# EasyEDA Pro project 校赛123.eprj, board PCB9
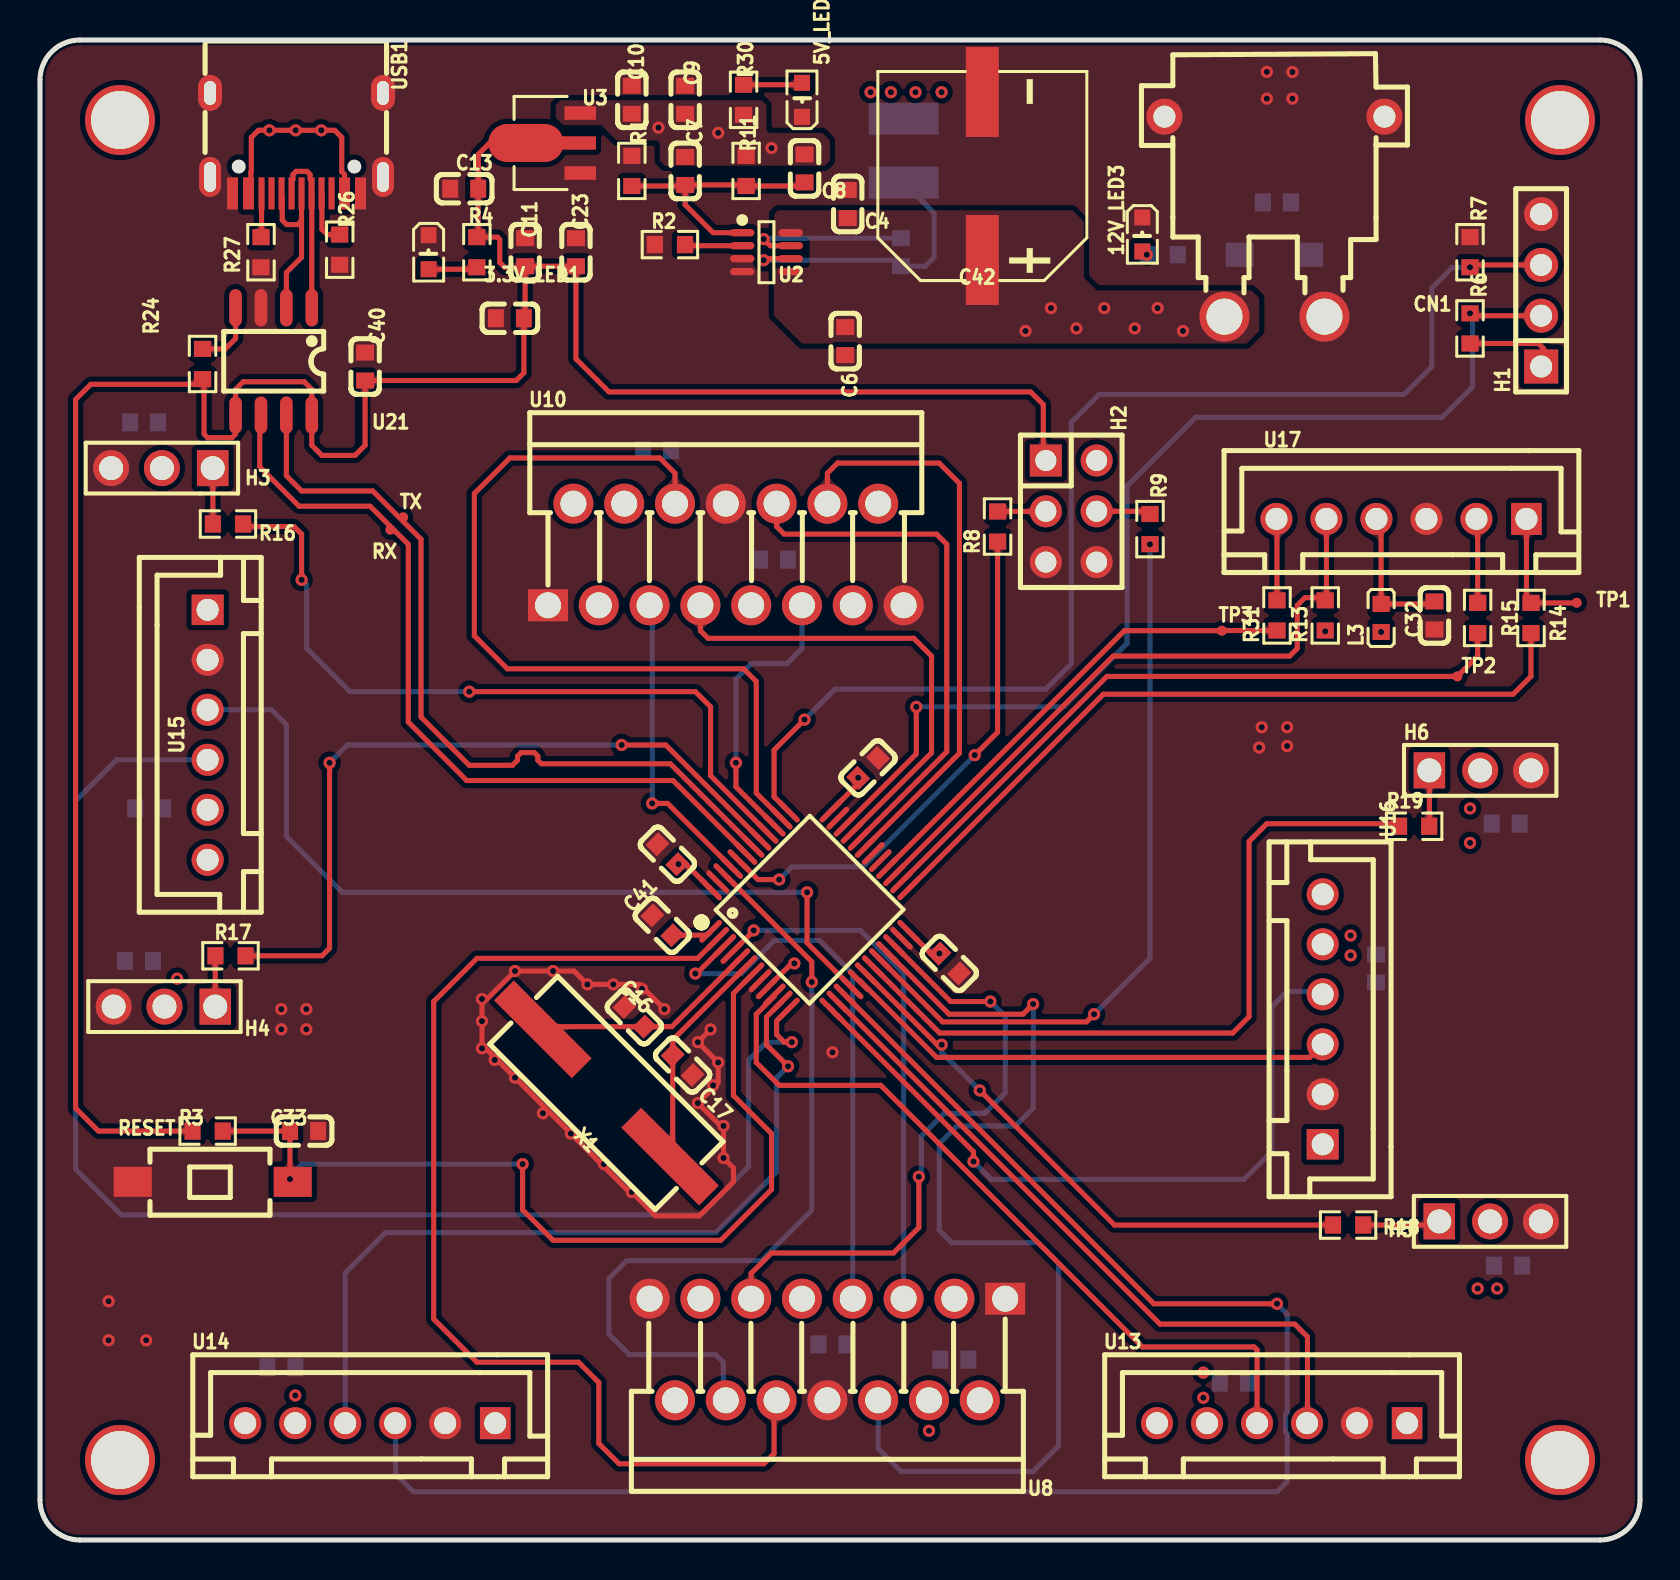
[diagram p4: board, top side]
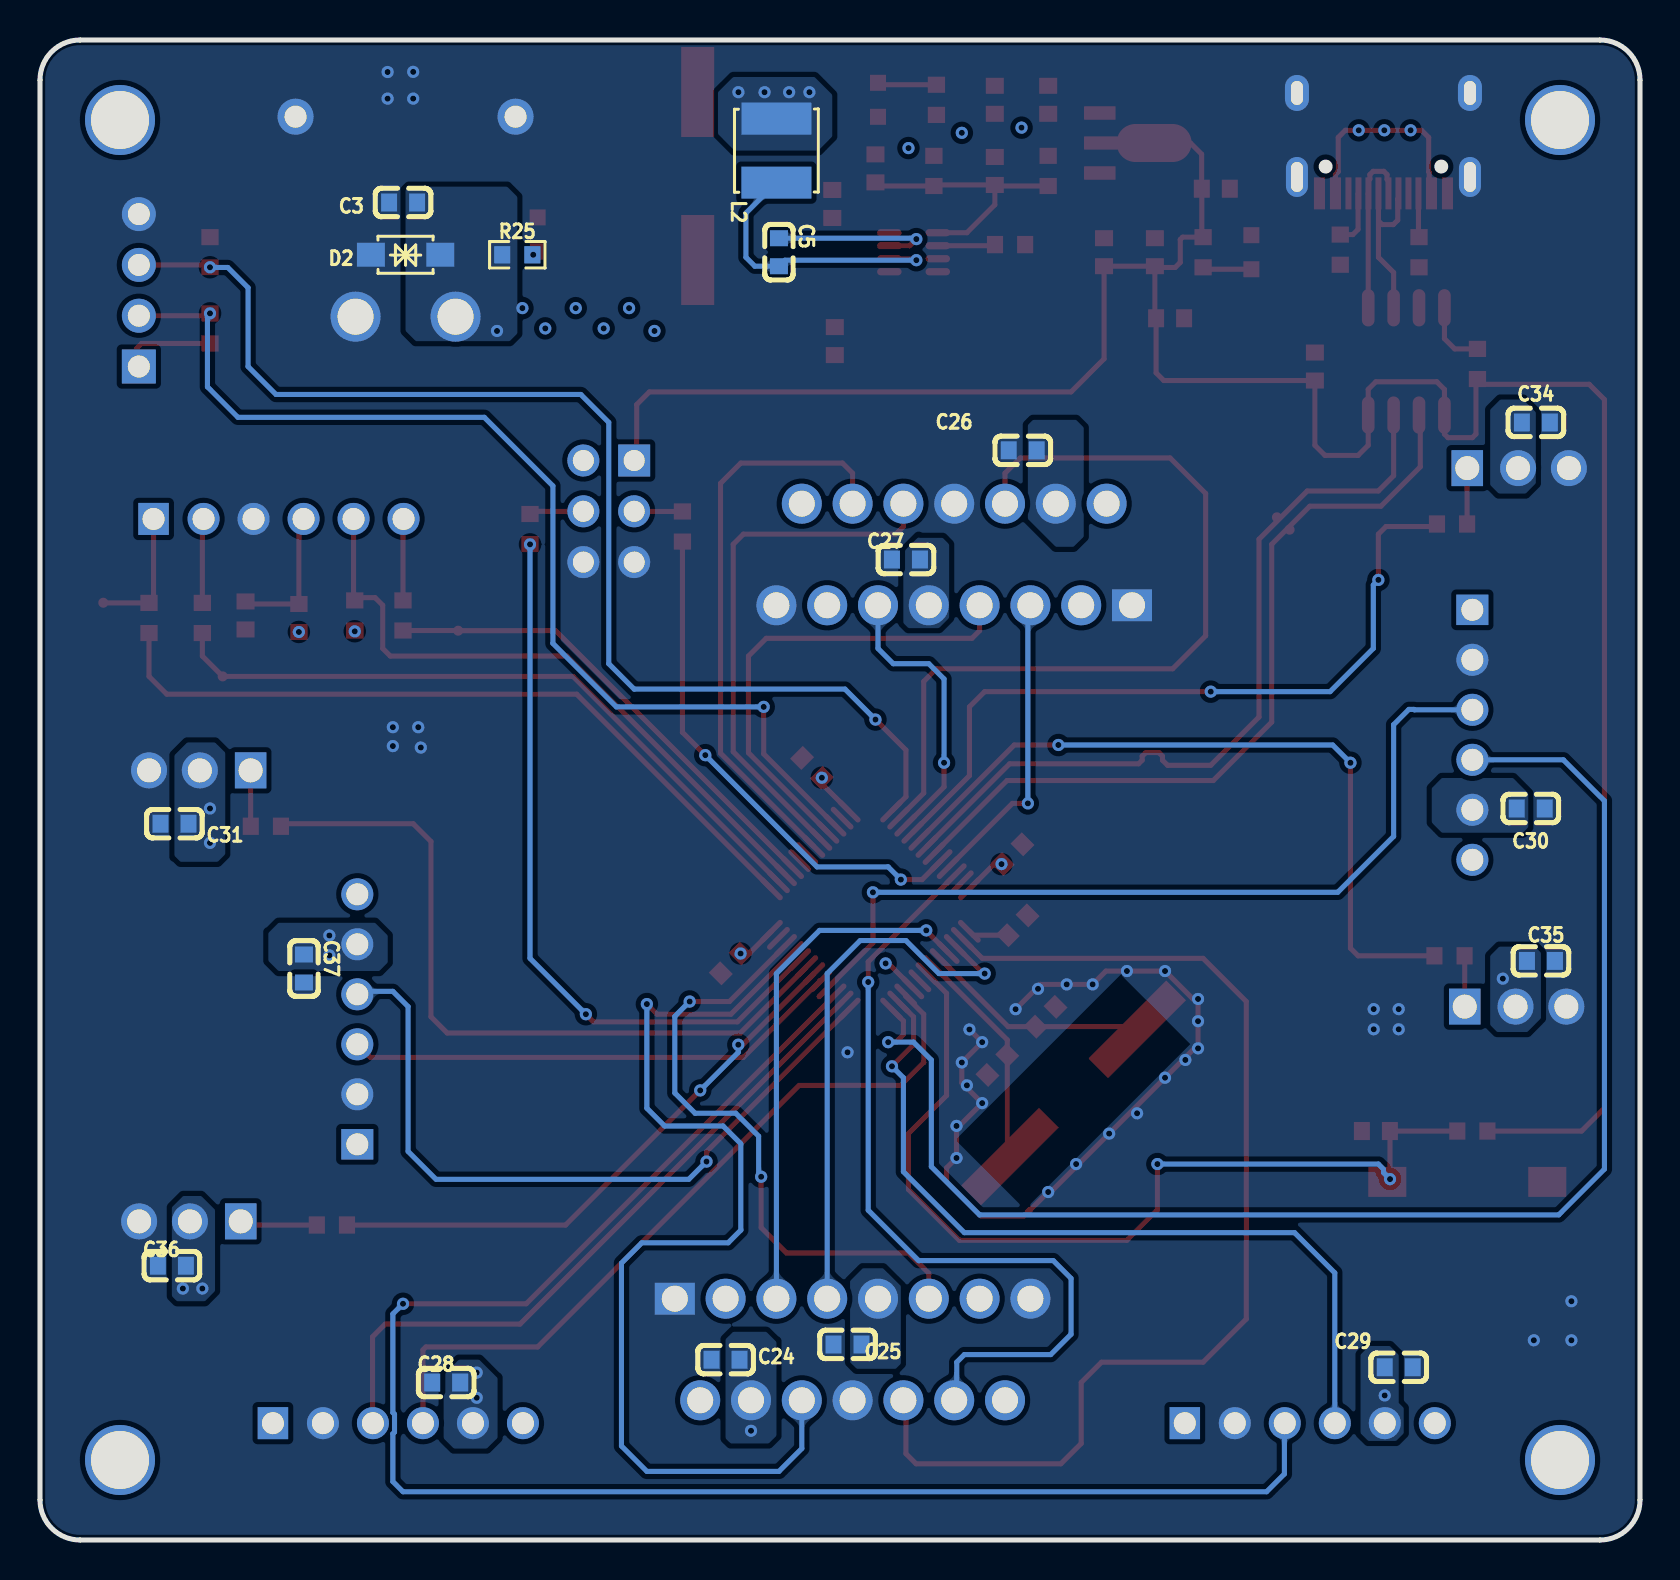
[diagram p5: board, bottom side, seen from below]

Outline 80 x 75 mm; copper layers: Top Layer, Inner1, Inner2, Bottom Layer. Coordinates in mm from the lower left corner of the outline.
Outline path: 0,73 0,2 arc(0.59,0.59) 2,0 78,0 arc(79.41,0.59) 80,2 80,73 arc(79.41,74.41) 78,75 2,75 arc(0.59,74.41) 0,73
Stack: Top Layer 0.035mm 外层铜厚1oz / Dielectric1 0.2104mm 7628 RC49% 8.6mil / Inner1 0.0152mm 内层铜厚 / Dielectric2 1.065mm 1.1mm H/HOZ Copper / Inner2 0.0152mm 内层铜厚 / Dielectric3 0.2104mm 7628 RC49% 8.6mil / Bottom Layer 0.035mm 外层铜厚1oz

## Design rules (mm)
net OSCIN: DP1
net OSCOUT: DP1
net TX: DP3
net RX: DP3
template: 自定义配置
spacing copperThickness1oz (default): track to track 0.102, other pairs 0.152 to 0.3
spacing copperThickness2oz: track to track 0.203, other pairs 0.152 to 0.3
track width copperThickness1oz (default): min 0.127, default 0.254, max 2.54
track width copperThickness2oz: min 0.203, default 0.254, max 2.54
differential pair differentialPair (default): width min 0.127, default 0.254, max 2.54; gap min 0.152, default 0.152
via viaSize (default): diameter min 0.5, default 0.61, max 10; hole min 0.3, default 0.305, max 6.3

## Placement (name value [footprint] x y rotation side)
3.3V_LED1  SZYY0603R  [LED0603-R-RD]  19.43 64.39 270 top
5V_LED2  SZYY0603R  [LED0603-R-RD]  38.1 72.01 90 top
12V_LED3  SZYY0603R  [LED0603-R-RD]  55.12 65.28 270 top
C3  100nF  [C0603]  61.85 66.88 180 bottom
C4  4.7uF  [C0603]  40.39 66.8 270 top
C5  10nF  [C0603]  43.05 64.39 270 bottom
C6  100nF  [C0603]  40.26 59.94 90 top
C7  22uF  [C0603]  32.26 68.45 270 top
C8  100nF  [C0603]  38.23 68.58 90 top
C9  22uF  [C0603]  32.26 72.01 270 top
C10  22uF  [C0603]  29.59 72.01 270 top
C11  100nF  [C0603]  24.26 64.39 270 top
C13  10uF  [C0603]  21.21 67.56 0 top
C16  18pF  [C0603]  29.72 26.16 315 top
C17  18pF  [C0603]  32.13 23.75 135 top
C19  100nF  [C0603]  23.5 61.09 0 top
C20  100nF  [C0603]  45.47 28.83 135 top
C21  100nF  [C0603]  31.37 34.29 315 top
C22  100nF  [C0603]  41.4 38.61 225 top
C23  47uF  [C0603]  26.8 64.39 270 top
C24  100nF  [C0603]  45.72 9.02 180 bottom
C25  100nF  [C0603]  39.62 9.78 0 bottom
C26  100nF  [C0603]  30.86 54.48 180 bottom
C27  100nF  [C0603]  36.7 49.02 0 bottom
C28  100nF  [C0603]  59.69 7.87 0 bottom
C29  100nF  [C0603]  12.06 8.64 180 bottom
C30  100nF  [C0603]  5.46 36.58 180 bottom
C31  100nF  [C0603]  73.28 35.81 0 bottom
C32  100nF  [C0603]  69.72 46.23 270 top
C33  10uF  [C0603]  13.2 20.45 180 top
C34  10pF  [C0603]  5.21 55.88 180 bottom
C35  10pF  [C0603]  4.95 28.96 180 bottom
C36  10pF  [C0603]  73.41 13.72 0 bottom
C37  10pF  [C0603]  66.8 28.58 270 bottom
C40  100nF  [C0603]  16.26 58.67 90 top
C41  100nF  [C0603]  31.12 30.73 315 top
C42  470uF  [CAP-SMD_BD10.0-L10.3-W10.3-LS11.0]  47.12 68.2 90 top
CN1  XT30PW-M30.G.Y  [CONN-TH_XT30PW-M]  61.72 66.17 180 top
D2  SMF24CA  [SOD-123FL_L2.7-W1.8-LS3.8-BI]  61.72 64.26 180 bottom
H1  PZ254V-11-04P  [HDR-TH_4P-P2.54-V-M]  75.06 62.48 90 top
H2  2.54-2*3  [HDR-TH_6P-P2.54-V-R2-C3-S2.54_A2541WV-2X3P]  51.56 51.44 270 top
H3  2.54-1*3P针  [HDR-TH_3P-P2.54-V-M-1]  6.1 53.59 180 top
H4  2.54-1*3P针  [HDR-TH_3P-P2.54-V-M-1]  6.22 26.67 180 top
H5  2.54-1*3P针  [HDR-TH_3P-P2.54-V-M-1]  72.5 15.93 0 top
H6  2.54-1*3P针  [HDR-TH_3P-P2.54-V-M-1]  72.01 38.48 0 top
L2  15uH  [IND-SMD_L4.0-W4.0]  43.18 69.47 90 bottom
L3  GZ1608D601TF  [L0603]  67.06 46.1 90 top
NOREF  -  [Pad_e97]  4 71 0 top
NOREF#2  -  [Pad_e96]  76 71 0 top
NOREF#3  -  [Pad_e99]  76 4 0 top
NOREF#4  -  [Pad_e98]  4 4 0 top
R1  10.2kΩ  [R0603]  29.59 68.45 270 top
R2  68kΩ  [R0603]  31.5 64.77 0 top
R3  10kΩ  [R0603]  8.38 20.45 180 top
R4  10kΩ  [R0603]  21.84 64.39 270 top
R6  10kΩ  [R0603]  71.5 60.58 270 top
R7  10kΩ  [R0603]  71.5 64.39 270 top
R8  10kΩ  [R0603]  47.88 50.67 90 top
R9  10kΩ  [R0603]  55.5 50.55 270 top
R11  75kΩ  [R0603]  35.31 68.45 270 top
R13  10kΩ  [R0603]  64.26 46.23 90 top
R14  22Ω  [R0603]  74.55 46.1 90 top
R15  22Ω  [R0603]  71.88 46.1 90 top
R16  220Ω  [R0603]  9.4 50.8 180 top
R17  220Ω  [R0603]  9.53 29.21 180 top
R18  220Ω  [R0603]  65.41 15.75 0 top
R19  220Ω  [R0603]  68.71 35.69 0 top
R24  10kΩ  [R0603]  8.13 58.8 270 top
R25  33kΩ  [R0603]  56.13 64.26 180 bottom
R26  5.1kΩ  [R0603]  14.99 64.52 90 top
R27  5.1kΩ  [R0603]  11.05 64.39 90 top
R30  10kΩ  [R0603]  35.18 72.01 270 top
R31  22Ω  [R0603]  61.85 46.23 90 top
RESET  TS-1101-C-W  [SW-SMD_L6.0-W3.3-LS8.0]  8.64 17.91 0 top
RX  -  [Test-Point-0.5mm]  17.52 50.52 0 top
TP1  -  [Test-Point-0.5mm]  76.84 46.86 0 top
TP2  -  [Test-Point-0.5mm]  70.87 43.18 0 top
TP3  -  [Test-Point-0.5mm]  59.09 45.47 0 top
TX  -  [Test-Point-0.5mm]  18.15 51.14 0 top
U2  SY8303AIC  [TSOT-23-8_L2.9-W1.6-P0.65-LS2.8-BR]  36.32 64.39 180 top
U3  AMS1117-3.3  [SOT-89-3_L4.5-W2.5-P1.50-LS4.2-BR]  25.65 69.85 0 top
U7  STM32F103C8T6  [LQFP-48_L7.0-W7.0-P0.50-LS9.0-BL]  38.48 31.5 315 top
U8  L298N  [MULTIWATT-15_L19.6-W5.0-P1.27-L]  39.37 9.53 180 top
U10  L298N  [MULTIWATT-15_L19.6-W5.0-P1.27-L]  34.29 49.28 0 top
U13  ZX-XH2.54-6PZZ  [CONN-TH_6P-P2.50_ZX-XH2.54-6PZZ]  62.1 5.84 0 top
U14  ZX-XH2.54-6PZZ  [CONN-TH_6P-P2.50_ZX-XH2.54-6PZZ]  16.51 5.84 0 top
U15  ZX-XH2.54-6PZZ  [CONN-TH_6P-P2.50_ZX-XH2.54-6PZZ]  8.38 40.26 90 top
U16  ZX-XH2.54-6PZZ  [CONN-TH_6P-P2.50_ZX-XH2.54-6PZZ]  64.13 26.03 270 top
U17  ZX-XH2.54-6PZZ  [CONN-TH_6P-P2.50_ZX-XH2.54-6PZZ]  68.07 51.05 0 top
U21  CH340N  [SOP-8_L4.9-W3.9-P1.27-LS6.0-BL]  11.68 58.93 180 top
USB1  TYPE-C 16PIN 2MD(073)  [USB-C-SMD_TYPE-C-6PIN-2MD-073]  12.83 69.98 180 top
X1  8MHz  [CRYSTAL-SMD_L11.4-W4.7-LS12.7]  28.32 22.35 135 top

## Footprints (pads in the part's own frame, mm; a bottom-side part is the same pattern mirrored in y, then rotated)
C0603
  rect 0.8x0.9 smd: 1(-0.7,0) 2(0.7,0)
CAP-SMD_BD10.0-L10.3-W10.3-LS11.0
  rect 4.5x1.65 smd: 1(-4.2,0) 2(4.2,0)
CONN-TH_6P-P2.50_ZX-XH2.54-6PZZ
  rect 1.524x1.6 hole 1.1: 1(6.25,0)
  round 1.6 hole 1.1: 2(3.75,0) 3(1.25,0) 4(-1.25,0) 5(-3.75,0) 6(-6.25,0)
CONN-TH_XT30PW-M
  round 2.5 hole 1.8: 1(-2.5,5) 2(2.5,5)
  round 1.8 hole 1.1: 3(5.5,-5) 4(-5.5,-5)
CRYSTAL-SMD_L11.4-W4.7-LS12.7
  rect 5.5x1.4 smd: 1(-4.5,0) 2(4.5,0)
HDR-TH_3P-P2.54-V-M-1
  rect 1.575x1.8 hole 1.2: 1(-2.54,0)
  round 1.8 hole 1.2: 2(0,0) 3(2.54,0)
HDR-TH_4P-P2.54-V-M
  rect 1.7x1.7 hole 1.1: 1(-3.81,0)
  round 1.7 hole 1.1: 2(-1.27,0) 3(1.27,0) 4(3.81,0)
HDR-TH_6P-P2.54-V-R2-C3-S2.54_A2541WV-2X3P
  rect 1.6x1.6 hole 1.05: 1(-2.54,-1.27)
  round 1.6 hole 1.05: 2(-2.54,1.27) 3(0,-1.27) 4(0,1.27) 5(2.54,-1.27) 6(2.54,1.27)
IND-SMD_L4.0-W4.0
  rect 1.6x3.5 smd: 1(-1.6,0) 2(1.6,0)
L0603
  rect 0.8x0.864 smd: 1(-0.7,0) 2(0.7,0)
LED0603-R-RD
  rect 0.8x0.8 smd: 1(0.851,0) 2(-0.851,0)
LQFP-48_L7.0-W7.0-P0.50-LS9.0-BL
  oval 0.27x1.5 smd: 1(-2.75,-4.25) 2(-2.25,-4.25) 3(-1.75,-4.25) 4(-1.25,-4.25) 5(-0.75,-4.25) 6(-0.25,-4.25) 7(0.25,-4.25) 8(0.75,-4.25) 9(1.25,-4.25) 10(1.75,-4.25) 11(2.25,-4.25) 12(2.75,-4.25) 25(2.75,4.25) 26(2.25,4.25) 27(1.75,4.25) 28(1.25,4.25) 29(0.75,4.25) 30(0.25,4.25) 31(-0.25,4.25) 32(-0.75,4.25) 33(-1.25,4.25) 34(-1.75,4.25) 35(-2.25,4.25) 36(-2.75,4.25)
  oval 1.5x0.27 smd: 13(4.25,-2.75) 14(4.25,-2.25) 15(4.25,-1.75) 16(4.25,-1.25) 17(4.25,-0.75) 18(4.25,-0.25) 19(4.25,0.25) 20(4.25,0.75) 21(4.25,1.25) 22(4.25,1.75) 23(4.25,2.25) 24(4.25,2.75) 37(-4.25,2.75) 38(-4.25,2.25) 39(-4.25,1.75) 40(-4.25,1.25) 41(-4.25,0.75) 42(-4.25,0.25) 43(-4.25,-0.25) 44(-4.25,-0.75) 45(-4.25,-1.25) 46(-4.25,-1.75) 47(-4.25,-2.25) 48(-4.25,-2.75)
MULTIWATT-15_L19.6-W5.0-P1.27-L
  rect 2x1.6 hole 1.3: 1(-8.89,-2.54)
  round 2 hole 1.3: 2(-7.62,2.54) 3(-6.35,-2.54) 4(-5.08,2.54) 5(-3.81,-2.54) 6(-2.54,2.54) 7(-1.27,-2.54) 8(0,2.54) 9(1.27,-2.54) 10(2.54,2.54) 11(3.81,-2.54) 12(5.08,2.54) 13(6.35,-2.54) 14(7.62,2.54) 15(8.89,-2.54)
Pad_e96
  round 3.5 hole 2.9: 1(0,0)
Pad_e97
  round 3.5 hole 2.9: 2(0,0)
Pad_e98
  round 3.5 hole 2.9: 3(0,0)
Pad_e99
  round 3.5 hole 2.9: 4(0,0)
R0603
  rect 0.806x0.864 smd: 1(-0.753,0) 2(0.753,0)
SOD-123FL_L2.7-W1.8-LS3.8-BI
  rect 1.4x1.2 smd: 1(-1.735,0) 2(1.735,0)
SOP-8_L4.9-W3.9-P1.27-LS6.0-BL
  oval 0.63x1.865 smd: 1(-1.905,-2.683) 2(-0.635,-2.683) 3(0.635,-2.683) 4(1.905,-2.683) 5(1.905,2.683) 6(0.635,2.683) 7(-0.635,2.683) 8(-1.905,2.683)
SOT-89-3_L4.5-W2.5-P1.50-LS4.2-BR
  rect 1.575x0.672 smd: 1(1.356,-1.5) 3(1.356,1.5)
  custom 5.377x1.9 smd: 2(-1.356,0)
SW-SMD_L6.0-W3.3-LS8.0
  rect 1.9x1.5 smd: 1(-4,0) 2(4,0)
Test-Point-0.5mm
  round 0.5 smd: 1(0,0)
TSOT-23-8_L2.9-W1.6-P0.65-LS2.8-BR
  oval 1.222x0.364 smd: 1(1.211,-0.975) 2(1.211,-0.325) 3(1.211,0.325) 4(1.211,0.975) 5(-1.211,0.975) 6(-1.211,0.325) 7(-1.211,-0.325) 8(-1.211,-0.975)
USB-C-SMD_TYPE-C-6PIN-2MD-073
  rect 0.55x1.6 smd: 1(-3.2,2.647) 2(-2.4,2.647) 11(2.4,2.647) 12(3.2,2.647)
  rect 0.3x1.6 smd: 3(-1.75,2.647) 4(-1.25,2.647) 5(-0.75,2.647) 6(-0.25,2.647) 7(0.25,2.647) 8(0.75,2.647) 9(1.25,2.647) 10(1.75,2.647)
  oval 1.1x2 hole 0.6x1.5: 13(-4.325,1.825) 14(4.325,1.825)
  oval 1.2x1.8 hole 0.6x1.2: 13(-4.325,-2.375) 14(4.325,-2.375)

## Nets
As in the schematic, except:
GND: 3.3V_LED1.2 5V_LED2.2 12V_LED3.2 C3.1 C4.1 C6.1 C9.1 C10.1 C11.1 C13.1 C16.1 C17.1 C19.1 C20.1 C21.1 C22.1 C23.1 C24.1 C25.2 C26.1 C27.2 C28.2 C29.2 C30.2 C31.2 C32.2 C33.1 C34.2 C35.2 C36.2 C37.2 C40.2 C41.1 C42.2 CN1.1 CN1.3 CN1.4 D2.1 H1.4 H2.5 H2.6 H3.3 H4.3 H5.3 H6.3 R1.1 R2.1 R7.1 R26.1 R27.1 RESET.1 U2.3 U2.4 U3.1 U7.8 U7.23 U7.35 U7.47 U8.1 U8.8 U8.15 U10.1 U10.8 U10.15 U13.2 U14.2 U15.2 U16.2 U17.3 U21.3 USB1.1 USB1.12 USB1.13 USB1.14
VCC_5V: C7.1 C8.2 C9.2 C10.2 C25.1 C27.1 C28.1 C29.1 C30.1 C31.1 C34.1 C35.1 C36.1 C37.1 H3.2 H4.2 H5.2 H6.2 L2.2 L3.1 R11.1 R30.2 U3.3 U8.9 U10.9 U13.5 U14.5 U15.5 U16.5 USB1.2 USB1.11
$3N28058: U21.2 USB1.6 USB1.8
$3N28062: R26.2 USB1.4

Pads without a net: NOREF 2; NOREF#2 1; NOREF#3 4; NOREF#4 3; U7 29 30; USB1 3 9

## Via types
v1: diameter 0.61, hole 0.305, Top Layer to Bottom Layer, 104 vias

## Routing (per net, layer and track width the routed paths; a pad name or vN(x,y) marks a point on that pad's centre or on a via; arc(x,y) is an arc through that point)
GND: length 39.2
  Top Layer w0.254: 30.2,27.56 v1(30.1,27.56) ; 30.2,27.56 v1(31.22,26.54) ; 30.2,27.56 29.98,27.78 v1(28.66,27.78) v1(27.37,27.78) 26.7,28.45 v1(25.65,28.45) v1(23.75,28.45) 22.35,27.05 v1(22.1,27.05) v1(22.1,25.94) 22.1,24.77 v1(23.75,23.11) v1(26.54,20.32) 29.46,17.4 v1(29.59,17.4) 30.48,16.51 30.54,16.51 30.61,16.45 30.61,16.38 30.79,16.2 32.97,16.2 34.67,17.91 34.67,18.61 v1(34.18,19.1) 34.18,20.56 v1(32.89,21.84) 33.91,22.86 v1(33.91,23.88) v1(32.89,24.89) v1(33.53,25.53)
  vias: v1(3.43,11.94) v1(3.43,9.99) v1(5.31,9.99) v1(12.06,26.54) v1(12.06,25.54) v1(13.31,26.55) v1(13.31,25.54) v1(22.1,24.58) v1(22.73,24) v1(25.15,21.34) v1(28.19,18.8) v1(33.66,22.73) v1(34.18,20.7) v1(39.62,24.38) v1(60.96,39.62) v1(61.09,40.64) v1(61.34,73.41) v1(61.34,72.07) v1(62.36,40.64) v1(62.36,39.7) v1(62.62,73.4) v1(62.62,72.07)
VCC_3V3: length 268.7
  Top Layer w0.254: C11.2 24.19,63.63 23.24,63.63 22.99,63.88 22.99,65.02 22.87,65.14 R4.1 21.91,65.21 C13.2 21.92,67.57 21.92,69.29 22.48,69.85 U3.2 ; C11.2 C23.2 26.8,59.06 28.45,57.4 49.53,57.4 50.16,56.77 50.16,54.1 H2.1 ; C11.2 24.26,61.15 C19.2 24.19,58.36 23.81,57.97 C40.1 16.26,54.74 15.75,54.23 14.1,54.23 13.59,54.74 U21.8 13.59,57.53 13.21,57.91 10.16,57.91 9.78,57.53 U21.5 9.78,55.3 9.6,55.12 8.38,55.12 8.2,55.3 8.2,57.97 R24.2 7.87,57.78 2.54,57.78 1.78,57.02 1.78,21.59 2.92,20.45 R3.2 ; U7.48 32.29,33.8 v1(31.92,33.8) ; v1(37.72,28.83) 37.58,28.83 36.36,27.61 ; R6.2 74.92,59.83 75.18,59.56 75.18,58.8 H1.1 ; U7.36 40.91,37.81 v1(40.91,38.11) ; v1(44.97,29.32) 44.54,29.32 U7.24
  Inner1 w0.254: H1.1 74.93,58.8 66.8,58.8 65.66,57.66 65.66,46.83 v1(64.26,45.43) 57.56,45.43 56.39,46.61 56.39,52.45 54.86,53.97 H2.2 H2.1 46.23,53.97 44.96,52.7 44.96,50.04 44.32,49.4 23.62,49.4 22.86,48.64 22.86,37.34 26.4,33.8 v1(31.92,33.8) 37.12,38.99 40.03,38.99 v1(40.91,38.11) 46.23,32.79 46.23,30.73 44.97,29.48 v1(44.97,29.32) 42.8,31.5 40.39,31.5 v1(37.72,28.83)
VCC_5V: length 10.5
  Top Layer w0.254: USB1.2 15.23,68.27 15.09,68.41 15.09,70.13 14.73,70.48 v1(14.06,70.48) v1(12.78,70.48) v1(11.47,70.48) 10.92,70.48 10.57,70.13 10.57,68.41 10.54,68.39 10.54,67.44 10.43,67.33
  vias: v1(6.86,28.07) v1(12.77,7.23) v1(30.92,70.62) v1(33.91,70.36) v1(36.58,69.6) v1(41.53,72.39) v1(42.54,72.39) v1(43.77,72.39) v1(45.08,72.39) v1(58.17,8.37) v1(58.17,7.11) v1(65.53,30.23) v1(65.53,29.23) v1(67.06,45.4) v1(71.5,36.58) v1(71.5,34.86) v1(71.88,12.57) v1(72.86,12.57)
VCC_12V:
  vias: v1(44.45,5.46) v1(49.28,60.45) v1(50.55,61.59) v1(51.82,60.58) v1(53.21,61.59) v1(54.74,60.58) v1(55.88,61.59) v1(57.15,60.45)
BOOT0: length 25.9
  Top Layer w0.254: v1(46.74,39.24) 47.88,40.39 R8.1 ; v1(36.96,33.02) 35.9,33.02 34.95,33.97
  Bottom Layer w0.254: v1(46.74,39.24) 41.15,33.66 37.59,33.66 v1(36.96,33.02)
BOOT1: length 36.8
  Top Layer w0.254: v1(52.71,26.29) 52.32,25.91 45.13,25.91 42.02,29.02
  Bottom Layer w0.254: v1(55.5,49.78) 55.5,29.08 v1(52.71,26.29)
LDA: length 40.7
  Top Layer w0.254: v1(37.4,23.69) 36.32,24.77 36.32,26.16 37.07,26.9
  Bottom Layer w0.254: 37.47,23.75 36.83,23.11 36.83,18.42 33.78,15.37 17.27,15.37 15.26,13.36 U14.4
LDB: length 84.9
  Top Layer w0.254: U7.15 55.69,11.81 v1(61.85,11.81)
  Bottom Layer w0.254: U14.3 17.78,5.82 17.78,3.3 18.67,2.41 61.85,2.41 62.36,2.92 62.36,5.31 62.27,5.4 62.27,6.29 62.36,6.37 62.36,11.3 v1(61.85,11.81)
LDIN1: length 56.1
  Top Layer w0.254: U7.2 32.89,29.08 21.84,29.08 19.69,26.92 19.69,11.05 21.84,8.89 26.92,8.89 27.94,7.87 27.94,4.83 28.96,3.81 36.19,3.81 36.7,4.32 36.7,6.86 U8.10
LDIN2: length 41.2
  Top Layer w0.254: U7.46 38.59,28.91 v1(38.59,27.9)
  Bottom Layer w0.254: v1(38.59,27.9) 38.59,16.49 36.07,13.97 29.34,13.97 28.45,13.08 28.45,10.29 29.46,9.27 33.78,9.27 34.16,8.89 34.16,7.11 U8.12
LDPWM: length 31.1
  Top Layer w0.254: 35.56,12.06 35.56,13.33 36.58,14.35 42.67,14.35 43.94,15.62 v1(43.94,18.16) ; U7.22 45.53,26.92 v1(47.52,26.92)
  Bottom Layer w0.254: v1(43.94,18.16) 44.07,18.29 44.07,20.19 45.21,21.34 47.24,21.34 48.26,22.35 48.26,26.18 v1(47.52,26.92)
LUA: length 38.4
  Top Layer w0.254: U7.10 36.71,27.19 35.81,26.29 35.81,23.88 36.96,22.73 42.04,22.73 55.12,9.65 60.71,9.65 60.85,9.5 U13.4
LUB: length 34.7
  Top Layer w0.254: U13.3 63.37,5.86 63.37,10.16 62.74,10.79 56,10.79 U7.14
LUIN1: length 26.2
  Top Layer w0.254: U7.4 35.69,30.47 v1(35.69,30.48)
  Bottom Layer w0.254: v1(35.69,30.48) 41.02,30.48 43.18,28.32 43.18,12.06
LUIN2: length 27.5
  Top Layer w0.254: 32.89,28.32 32.89,28.38 U7.3
  Bottom Layer w0.254: v1(32.77,28.32) 35.05,28.32 36.7,29.97 38.99,29.97 40.64,28.32 40.64,12.06
LUPWM: length 52
  Top Layer w0.254: v1(49.66,26.8) 49.15,26.29 45.46,26.29 U7.21
  Bottom Layer w0.254: v1(49.66,26.8) 49.66,21.59 48.77,20.7 45.85,20.7 44.96,19.81 44.96,15.49 45.59,14.86 49.91,14.86 50.93,13.84 50.93,4.7 49.66,3.43 43.05,3.43 41.91,4.57 U8.6
MG_PWM1: length 37.8
  Top Layer w0.254: v1(21.46,42.42) 32.77,42.42 33.53,41.66 33.53,38.22 36.36,35.39 ; R16.1 10.28,50.67 12.7,50.67 13.08,50.29 v1(13.08,48.01)
  Bottom Layer w0.254: v1(13.08,48.01) 13.33,47.75 13.33,44.58 15.49,42.42 v1(21.46,42.42)
MG_PWM2: length 37.5
  Top Layer w0.254: v1(29.08,39.75) 31.29,39.75 U7.41 ; R17.1 14.1,29.21 14.48,29.59 v1(14.48,38.86)
  Bottom Layer w0.254: v1(14.48,38.86) 15.37,39.75 v1(29.08,39.75)
MG_PWM3: length 28.6
  Top Layer w0.254: 47.12,22.35 53.72,15.75 R18.1 ; U7.18 44.86,24.77 v1(45.09,24.77)
  Bottom Layer w0.254: v1(46.99,22.48) 45.09,24.38 v1(45.09,24.77)
MG_PWM4: length 37.2
  Top Layer w0.254: 41.66,28.67 44.98,25.35 59.64,25.35 60.45,26.16 60.45,34.92 61.34,35.81 67.83,35.81 R19.1
OSCIN: length 11.3
  Top Layer w0.254: X1.2 25.27,25.67 C16.2 31.59,25.67 34.95,29.02
OSCOUT: length 11.1
  Top Layer w0.254: 31.5,19.17 31.64,19.3 C17.2 31.64,25 U7.6
PS2_CLK: length 24.4
  Top Layer w0.254: U7.28 54.22,45.47 TP3.1 59.1,45.47 R31.1
PS2_CMD: length 34.6
  Top Layer w0.254: 43.08,32.91 53.35,43.18 TP2.1 71.88,44.2 R15.1
PS2_DAT: length 37.7
  Top Layer w0.254: R14.1 74.55,43.18 73.66,42.29 53.16,42.29 U7.25
PS2_SEL: length 32.7
  Top Layer w0.254: U7.27 53.66,44.2 62.48,44.2 62.87,44.58 62.87,46.74 63.25,47.12 64.13,47.12 R13.2 64.32,47.04 U17.5
RDA: length 36.6
  Top Layer w0.254: v1(46.67,18.92) 46.67,19.41 U7.13
  Bottom Layer w0.254: v1(46.67,18.92) 47.56,18.03 60.2,18.03 61.59,19.43 61.59,26.67 62.36,27.43 63.99,27.43 U16.4
RDB: length 25
  Top Layer w0.254: U7.17 41,27.96 44.83,24.13 63.48,24.13 U16.3
RDIN1: length 26.6
  Top Layer w0.254: U7.32 45.34,39.41 45.34,49.78 44.83,50.29 37.21,50.29 36.83,50.67 U10.10
RDIN2: length 28.8
  Top Layer w0.254: U10.12 39.37,53.34 39.88,53.85 44.96,53.85 45.97,52.83 45.97,39.34 U7.31
RDPWM: length 14.2
  Top Layer w0.254: U7.39 34.8,37.65 v1(34.8,38.86)
  Bottom Layer w0.254: U10.11 38.1,44.58 37.34,43.81 35.56,43.81 34.8,43.05 v1(34.8,38.86)
RST: length 46.3
  Top Layer w0.254: R3.1 12.32,20.45 12.5,20.27 v1(12.5,18.04) RESET.2 ; U7.7 34.67,27.33 34.67,22.22 36.58,20.32 36.58,17.53 34.04,14.99 25.65,14.99 24.13,16.51 v1(24.13,18.8)
  Bottom Layer w0.254: v1(24.13,18.8) 13.08,18.8 12.83,18.54 12.83,18.37 v1(12.5,18.04)
RUA: length 71.8
  Top Layer w0.254: U7.12 36.83,25.96 36.83,25.27 37.21,24.89 v1(37.59,24.89)
  Bottom Layer w0.254: U15.4 3.83,39.01 1.78,36.96 1.78,18.54 4.06,16.26 33.02,16.26 35.43,18.67 35.43,24 36.32,24.89 v1(37.59,24.89)
RUB: length 42.8
  Top Layer w0.254: 40.6,27.61 38.35,29.86 v1(38.35,32.39)
  Bottom Layer w0.254: U15.3 11.28,41.51 11.3,41.53 11.56,41.53 12.32,40.77 12.32,35.18 15.11,32.39 v1(38.35,32.39)
RUIN1: length 15.3
  Top Layer w0.254: U7.45 31.38,36.83 v1(30.61,36.83)
  Bottom Layer w0.254: U10.5 30.61,46.61 v1(30.61,36.83)
RUIN2: length 23.8
  Top Layer w0.254: U10.7 33.02,45.47 33.4,45.08 43.69,45.08 44.58,44.2 44.58,39.36 40.6,35.39
RUPWM: length 42.1
  Top Layer w0.254: 37.07,36.09 35.81,37.34 35.81,42.93 35.18,43.56 23.37,43.56 21.72,45.21 21.72,52.32 23.5,54.1 30.99,54.1 31.75,53.34 U10.6
RX: length 40.1
  Top Layer w0.254: U21.6 10.99,56.18 10.99,53.66 12.95,51.69 16.51,51.69 18.41,49.78 18.41,40.89 21.34,37.97 31.65,37.97 U7.43
SWCLK: length 61.2
  Top Layer w0.254: v1(38.23,41.02) 36.7,39.5 36.7,37.16 U7.37 ; H1.3 71.62,63.75 v1(71.5,63.64)
  Bottom Layer w0.254: 71.63,63.63 70.61,63.63 69.6,62.61 69.6,58.67 68.2,57.28 52.96,57.28 51.56,55.88 51.56,43.81 50.29,42.55 39.75,42.55 v1(38.23,41.02)
SWDIO: length 53.4
  Top Layer w0.254: U7.34 43.81,39.31 43.81,41.4 ; v1(71.5,61.33) 71.62,61.21 H1.2
  Bottom Layer w0.254: 71.63,61.21 71.63,57.66 70.1,56.13 57.78,56.13 54.36,52.7 54.36,44.83 51.18,41.66 v1(43.81,41.66)
TX: length 40
  Top Layer w0.254: U7.42 31.52,38.81 25.07,38.81 24.89,38.99 24.89,39.19 24.71,39.37 24.06,39.37 23.88,39.19 23.88,38.99 23.62,38.73 21.46,38.73 19.05,41.15 19.05,50.04 16.64,52.45 13.08,52.45 12.32,53.21 U21.7
$3N1810: length 14.6
  Top Layer w0.254: 37.53,64.06 36.26,64.06 v1(36.18,63.99)
  Bottom Layer w0.254: v1(36.18,63.99) 42.75,63.99 C5.2 44.26,63.69 44.7,64.14 44.7,66.34 L2.1
$3N1826: length 8.4
  Top Layer w0.254: 37.53,64.71 36.51,64.71 v1(36.18,65.05)
  Bottom Layer w0.254: v1(36.18,65.05) 36.23,65.09 C5.1
$3N2500: length 13.2
  Top Layer w0.254: C7.2 32.2,67.7 R1.2 ; C7.2 35.25,67.75 R11.2 38.05,67.7 C8.1 ; C7.2 32.26,66.76 33.66,65.36 U2.1
$3N2612: length 2.9
  Top Layer w0.254: R2.2 32.31,64.71 U2.2
$3N9576: length 2.5
  Top Layer w0.254: R4.2 21.75,63.54 3.3V_LED1.1
$3N9713: length 2
  Top Layer w0.254: C41.2 33.34,30.24 U7.1
$3N11117: length 2.4
  Top Layer w0.254: H2.3 50.28,51.43 R8.2
$3N11124: length 2.7
  Top Layer w0.254: H2.4 55.36,51.44 R9.1
$3N11714: length 3
  Top Layer w0.254: 5V_LED2.1 38,72.76 R30.1
$3N11908:
  vias: v1(55.34,64.26)
$3N23002: length 6.6
  Top Layer w0.254: TP1.1 76.83,46.85 R14.2 74.32,47.08 U17.1
$3N23007: length 4.1
  Top Layer w0.254: R31.2 61.85,51.03 U17.6
$3N23602: length 4.2
  Top Layer w0.254: R15.2 71.88,50.99 U17.2
$3N23821: length 7.1
  Top Layer w0.254: U17.4 67.06,50.82 L3.2 69.6,46.8 C32.1
$3N24477: length 2.8
  Top Layer w0.254: H3.1 8.64,53.59 R16.2
$3N24721: length 2.5
  Top Layer w0.254: H4.1 8.76,29.2 R17.2
$3N24879: length 3.9
  Top Layer w0.254: H5.1 69.78,15.75 R18.2
$3N25037: length 2.8
  Top Layer w0.254: R19.2 69.47,35.7 H6.1
$3N27553: length 3.4
  Top Layer w0.254: U21.4 9.78,60.07 9.26,59.55 R24.1
$3N28058: length 8.5
  Top Layer w0.254: U21.2 12.32,63.37 13.08,64.13 USB1.6 ; USB1.8 12.08,67.08 12.11,67.04 12.11,65.99 12.33,65.77 12.89,65.77 13.08,65.96
$3N28060: length 8.7
  Top Layer w0.254: USB1.7 12.58,67.97 12.65,68.04 12.65,68.27 12.81,68.43 13.34,68.43 13.51,68.27 13.51,68.05 13.58,67.98 USB1.5 13.59,67.32 U21.1
$3N28062: length 2.8
  Top Layer w0.254: USB1.4 14.1,67.31 14.1,65.53 14.36,65.27 R26.2
$3N28063: length 2.2
  Top Layer w0.254: R27.2 11.08,65.17 USB1.10

## Copper pours and planes (outline as drawn; the poured copper is in the pictures)
GND on Top Layer: -8.38,79.76 119.76,79.76 119.76,-8.51 -8.38,-8.51
GND on Bottom Layer: -71.12,111.38 180.21,111.38 180.21,-40.51 -71.12,-40.51
GND on Inner1: -126.49,149.73 305.05,149.73 305.05,-113.03 -126.49,-113.03
GND on Inner2: -187.58,216.41 363.35,216.41 363.35,-227.96 -187.58,-227.96
VCC_5V on Top Layer: 36.09,71.99 36.32,71.75 36.32,70.48 36.45,70.36 39.12,70.36 39.5,69.98 39.5,68.96 39.24,68.71 31.24,68.71 30.99,68.96 30.99,69.85 30.86,69.98 28.83,69.98 28.07,70.74 26.16,70.74 25.78,71.12 25.78,71.75 26.01,71.99
VCC_5V on Bottom Layer: 12.51,9.7 12.06,9.26 12.06,6.86 11.81,6.6 11.81,5.33 12.19,4.95 13.59,4.95 13.97,5.33 13.97,9.27 13.54,9.7
VCC_5V on Bottom Layer: 6.35,38.1 5.59,37.34 5.59,35.63 5.85,35.36 9.91,35.36 10.41,35.87 10.41,37.59 9.91,38.1
VCC_5V on Bottom Layer: 71.25,39.88 70.74,39.37 70.74,34.29 71.12,33.91 72.98,33.91 73.23,34.16 73.28,34.16 73.28,39.24 72.64,39.88
VCC_5V on Bottom Layer: 63.25,30.86 62.61,30.23 62.61,28.87 63.03,28.45 68.07,28.45 68.58,28.96 68.58,30.39 68.54,30.39 68.07,30.86
VCC_5V on Bottom Layer: 5.25,29.67 4.95,29.37 4.95,26.08 5.64,25.4 7.14,25.4 7.49,25.75 7.49,29.21 7.04,29.67
VCC_5V on Bottom Layer: 57.15,8.13 57.12,8.13 57.12,5.1 57.66,4.57 59.31,4.57 59.82,5.08 59.82,8.25 59.06,9.02 58.04,9.02
VCC_5V on Bottom Layer: 71.94,17.2 71.25,16.51 71.25,12.45 71.75,11.94 73.15,11.94 73.41,12.19 73.41,16.64 72.84,17.2
VCC_5V on Bottom Layer: 5.84,57.02 5.21,56.39 5.21,52.83 5.72,52.32 7.07,52.32 7.49,52.75 7.49,56.52 6.98,57.02
VCC_5V on Bottom Layer: 34.86,50.1 34.54,49.78 34.54,46.1 35.05,45.59 36.58,45.59 36.83,45.85 36.83,49.4 36.07,50.17 36.01,50.1
VCC_5V on Bottom Layer: 41.28,73.15 40.39,72.26 40.39,70.17 41.08,69.47 45.28,69.47 46.1,70.3 46.1,72.39 45.34,73.15
VCC_5V on Bottom Layer: 37.85,13.59 36.96,12.7 36.96,8.81 37.21,8.56 39.16,8.56 39.5,8.89 39.5,12.95 38.86,13.59
VCC_5V on Inner1: 70.64,36.55 71.25,35.94 72.98,35.94 73.56,36.52 73.56,42.01 70.99,44.58 38.1,44.58 36.83,45.85 36.83,48.13 35.45,48.13 34.29,47.36 34.29,44.45 36.19,42.55 69.47,42.55 70.64,41.38
VCC_5V on Inner2: 65.66,17.02 68.45,14.22 70.87,14.22 71.27,14.62 71.27,26.65 69.47,28.45 62.39,28.45 61.9,28.93 61.9,30.53 62.35,30.97 69.32,30.97 70.49,32.13 70.49,39.75 65.79,44.45 65.79,45.59 66.29,46.1 68.07,46.1 73.32,40.85 73.32,32.85 74.93,31.24 74.93,17.53 74.04,16.64 73.91,16.64 73.91,12.19 72.9,11.18 66.17,11.18 63.88,13.46 60.71,13.46 59.82,12.57 59.82,5.08 59.31,4.57 57.79,4.57 57.4,4.95 57.4,12.83 56.52,13.72 39.88,13.72 39.5,13.34 39.5,11.05 38.86,10.41 37.59,10.41 36.83,11.18 36.83,14.03 36.64,14.22 17.65,14.22 14.1,10.67 14.1,5.33 13.34,4.57 11.94,4.57 11.56,4.95 11.56,7.49 11.13,7.92 8.53,7.92 4.83,11.62 4.83,28.96 2.16,31.62 1.78,31.62 1.78,50.35 4.32,52.89 4.32,52.96 4.66,53.3 4.66,55.37 4.7,55.41 4.7,67.95 10.41,73.66 44.7,73.66 46.1,72.26 46.1,66.93 45.21,66.04 9.53,66.04 8.51,65.02 8.51,57.28 7.49,56.26 7.49,52.07 5.72,50.29 5.72,38.74 6.6,37.85 9.27,37.85 9.78,37.34 9.78,35.81 9.53,35.56 6.99,35.56 6.35,34.93 6.35,32.04 7.75,30.64 7.75,19.05 9.78,17.02
VCC_12V on Top Layer: 51.63,66.48 52.2,65.91 52.2,63.12 52.83,62.48 60.58,62.48 60.96,62.1 60.96,60.45 60.32,59.82 38.1,59.82 36.69,61.22 36.69,63.49 36.83,63.63 38.35,63.63 38.48,63.75 38.48,65.02 38.35,65.15 36.83,65.15 36.7,65.28 36.7,66.29 36.89,66.48
VCC_12V on Bottom Layer: 43.69,10.41 43.21,9.94 43.18,9.94 43.18,5.21 43.56,4.83 45.47,4.83 45.72,5.08 45.72,10.04 45.34,10.41
VCC_12V on Bottom Layer: 30.35,56.01 30.61,55.75 30.61,51.05 29.21,49.66 28.32,49.66 27.81,50.17 27.81,55.63 28.19,56.01
VCC_12V on Bottom Layer: 56.64,67.67 61.55,67.67 61.72,67.5 61.72,60.45 61.21,59.94 56.51,59.94 56.13,60.33 56.13,67.16
VCC_12V on Inner1: 59.44,63.2 61.72,60.91 61.72,58.04 60.07,56.39 32.39,56.39 30.61,54.6 30.61,50.93 29.46,49.78 28.19,49.78 27.56,50.42 27.56,53.72 26.67,54.61 25.02,54.61 19.43,49.02 19.43,22.22 29.08,12.57 29.08,5.97 29.59,5.46 42.8,5.46 43.31,5.97 43.31,8.38 43.66,8.74 45.35,8.74 45.68,8.41 45.68,3.23 44.88,2.41 26.16,2.41 24.13,4.44 23.88,4.44 23.88,9.14 15.49,17.53 15.49,52.58 26.12,63.2
OUTPUT1 on Inner2: 46.1,8.13 45.68,7.71 45.68,2.2 46.35,1.52 69.22,1.52 69.85,2.16 69.85,6.99 69.22,7.62 67.66,7.62 67.18,7.15 67.18,4.38 66.86,4.05 49.64,4.05 49.17,4.52 49.17,7.64 48.65,8.16 48.62,8.13
OUTPUT2 on Inner2: 44.83,13.46 44.45,13.08 44.45,9.36 45.46,8.35 53.75,8.35 54.36,7.75 54.36,5.21 54.99,4.57 56.77,4.57 57.15,4.95 57.15,9.78 56.64,10.29 47.73,10.29 46.97,11.05 46.97,13.08 46.59,13.46
OUTPUT3 on Inner2: 32.38,13.59 31.88,13.08 31.88,11.3 30.99,10.41 22.48,10.41 21.59,9.53 21.59,5.08 21.97,4.7 23.37,4.7 23.88,5.21 23.88,7.88 24.5,8.51 33.02,8.51 34.29,9.78 34.29,13.21 33.91,13.59
OUTPUT4 on Inner2: 30.81,8.25 30,7.44 30,4.03 29.14,3.18 11.62,3.18 11.3,3.49 11.3,6.73 10.92,7.11 9.4,7.11 9.14,6.86 9.14,1.91 9.53,1.52 32.38,1.52 33.03,2.17 33.03,7.69 32.46,8.25
OUTPUT5 on Inner2: 26.8,53.21 27.98,52.03 27.98,50.46 26.73,49.21 13.39,49.21 11.81,47.62 11.81,46.48 10.41,45.08 7.87,45.08 6.6,46.36 6.6,49.02 10.8,53.21
OUTPUT6 on Inner2: 27.26,47.97 26.8,47.5 26.8,44.96 16.89,35.05 7.87,35.05 6.86,34.04 6.86,32.84 7.42,32.28 19.92,32.28 20.07,32.13 29.21,41.28 29.21,47.62 28.87,47.97
OUTPUT7 on Inner2: 39.84,47.97 39.37,47.5 39.37,40.51 61.21,18.67 65.66,18.67 66.29,19.3 66.29,20.7 65.79,21.21 63.12,21.21 41.91,42.42 41.91,47.62 41.57,47.97
OUTPUT8 on Inner2: 41.4,53.21 40.89,52.7 40.89,49.78 42.42,48.26 43.56,48.26 45.09,46.74 45.09,42.16 56.01,31.24 64.9,31.24 65.91,32.26 65.91,33.53 64.9,34.54 59.06,34.54 48.77,44.83 48.77,48.01 43.56,53.21

Small or netless copper shapes (teardrops, artwork), in the pictures only: 199 on Top Layer, 46 on Bottom Layer, 14 on Inner1
